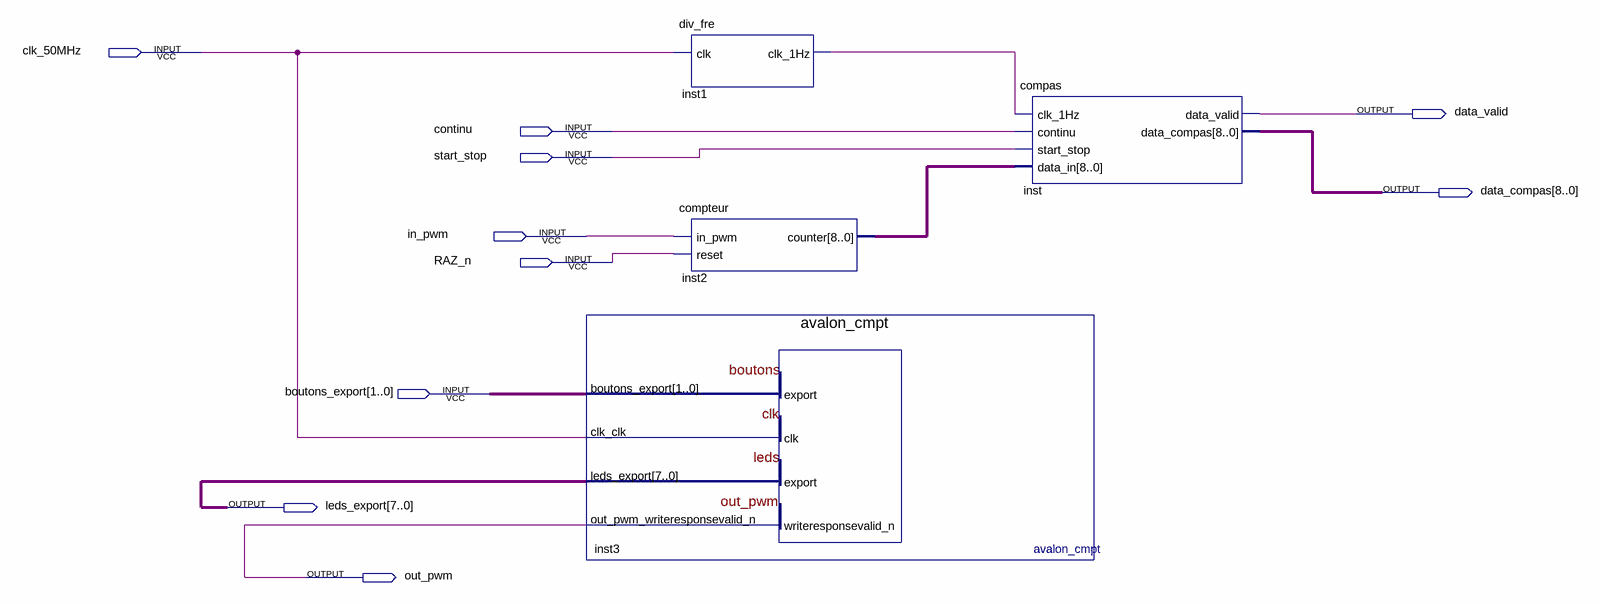
[diagram p0: schematic sheet]
// Quartus schematic fct_compas.bdf as structural Verilog: 4 symbols, 10 pins
module fct_compas (
  input  clk_50MHz,
  input  continu,
  input  start_stop,
  input  in_pwm,
  input  RAZ_n,
  input  [1:0] boutons_export,
  output data_valid,
  output [8:0] data_compas,
  output [7:0] leds_export,
  output out_pwm
);

  wire inst1_clk_1hz;
  wire [8:0] inst2_counter;

  avalon_cmpt inst3 (
    .boutons_export(boutons_export), .clk_clk(clk_50MHz), .leds_export(leds_export),
    .out_pwm_writeresponsevalid_n(out_pwm));
  div_fre inst1 (.clk(clk_50MHz), .clk_1Hz(inst1_clk_1hz));
  compteur inst2 (.in_pwm(in_pwm), .reset(RAZ_n), .counter(inst2_counter));
  compas inst (
    .clk_1Hz(inst1_clk_1hz), .continu(continu), .start_stop(start_stop), .data_in(inst2_counter),
    .data_valid(data_valid), .data_compas(data_compas));
endmodule
